# EAGLE design IEEEAdapter_v1 (EAGLE 5.11)
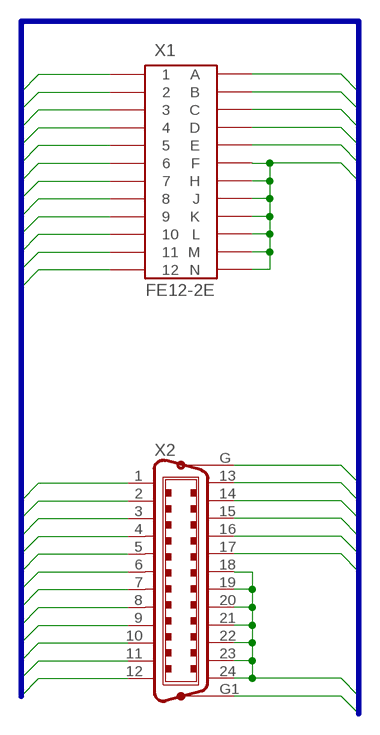
[diagram p0: schematic, sheet 1]

## Parts
X1  FE12-2E  [FE12-2_SHORT]
X2  C24HP  [24HP]

## Nets
ATN: X1.11 X2.11
D0: X1.1 X2.1
D1: X1.2 X2.2
D2: X1.3 X2.3
D3: X1.4 X2.4
D4: X1.A X2.13
D5: X1.B X2.14
D6: X1.C X2.15
D7: X1.D X2.16
DAV: X1.6 X2.6
EOI: X1.5 X2.5
GND: X1.12 X1.F X1.H X1.J X1.K X1.L X1.M X1.N X2.12 X2.18 X2.19 X2.20 X2.21 X2.22 X2.23 X2.24 X2.G X2.G1
IFC: X1.9 X2.9
NDAC: X1.8 X2.8
NRFD: X1.7 X2.7
REN: X1.E X2.17
SRQ: X1.10 X2.10

## Buses
D0,D1,D2,D3,EOI,DAV,NRFD,NDAC,IFC,SRQ,ATN,CHASSIS_GND,D4,D5,D6,D7,REN,GND

## Library data of the parts
X1 = con-edge-156:FE12-2
X2 = con-amp-champ:C24HP: CONNECTOR; OC_FARNELL: unknown; OC_NEWARK: unknown

## Board
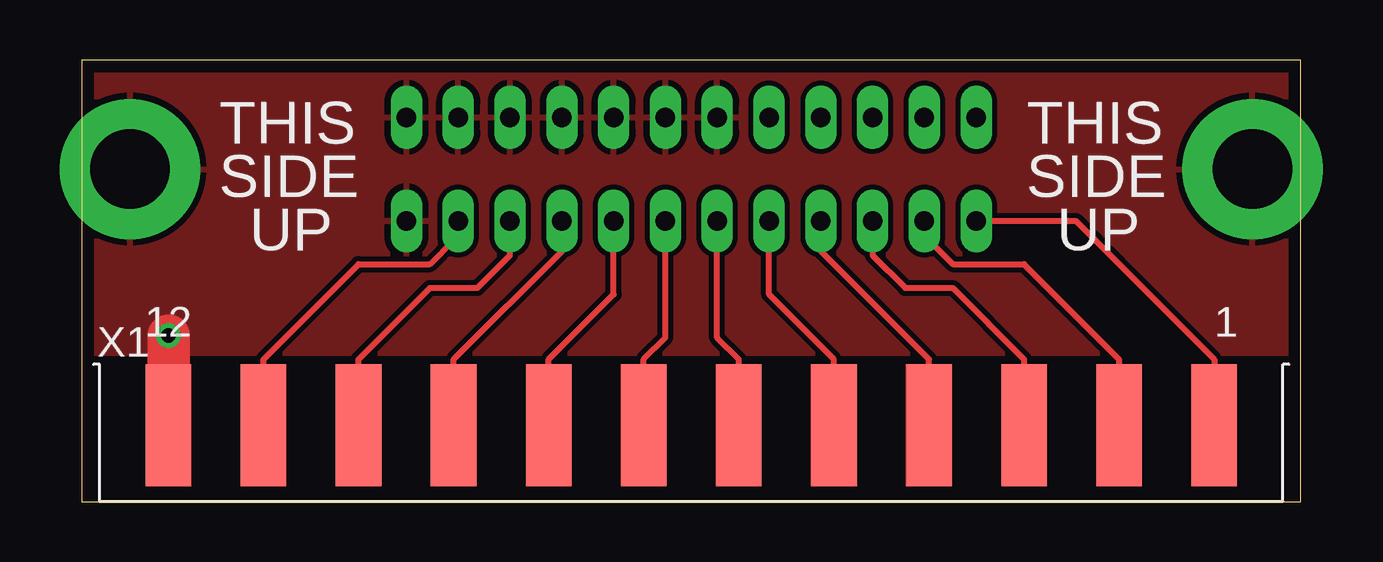
[diagram p1: board, top side]
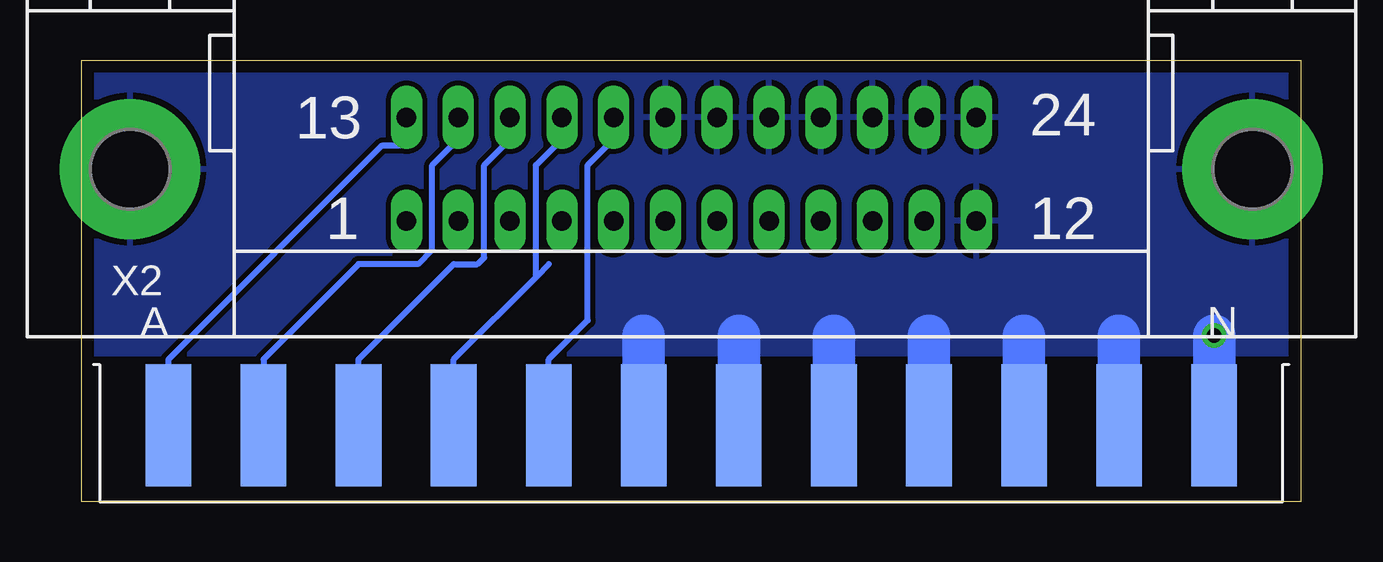
[diagram p2: board, bottom side, seen from below]

Size 50.8 x 18.41 mm. Coordinates in mm from the lower left corner, seen from the top.
Outline: 0,0 50.8,0 50.8,18.41 0,18.41 0,0
Copper layers (1*16): Top 0.035mm / dielectric 1.5mm / Bottom 0.035mm
Design rules "default *": minimum track width 10mil, minimum drill 24mil, track to track 8mil, track to pad 8mil, pad to pad 8mil, via to via 8mil, smd to smd 8mil, copper to edge 20mil, drill to drill 8mil, minimum pad ring 10mil, minimum via ring 8mil, stop-mask expansion 4mil, vias tented up to drill 0mil, thermal gap 10mil

### Footprints (pad centres in the part's own frame; a part is rotated, then mirrored left to right if it is on the bottom)
FE12-2_SHORT = smd 1.905 x 5.08: 1 -21.793,-0.216; 2 -17.831,-0.216; 3 -13.868,-0.216; 4 -9.906,-0.216; 5 -5.944,-0.216; 6 -1.981,-0.216; 7 1.981,-0.216; 8 5.944,-0.216; 9 9.906,-0.216; 10 13.868,-0.216; 11 17.831,-0.216; 12 21.793,-0.216 | smd 1.905 x 5.08 bottom: A -21.793,-0.216; B -17.831,-0.216; C -13.868,-0.216; D -9.906,-0.216; E -5.944,-0.216; F -1.981,-0.216; H 1.981,-0.216; J 5.944,-0.216; K 9.906,-0.216; L 13.868,-0.216; M 17.831,-0.216; N 21.793,-0.216
24HP = drill 0.813 long: 1 -11.874,-2.159; 2 -9.716,-2.159; 3 -7.556,-2.159; 4 -5.397,-2.159; 5 -3.239,-2.159; 6 -1.079,-2.159; 7 1.079,-2.159; 8 3.239,-2.159; 9 5.397,-2.159; 10 7.556,-2.159; 11 9.716,-2.159; 12 11.874,-2.159; 13 -11.874,2.159; 14 -9.716,2.159; 15 -7.556,2.159; 16 -5.397,2.159; 17 -3.239,2.159; 18 -1.079,2.159; 19 1.079,2.159; 20 3.239,2.159; 21 5.397,2.159; 22 7.556,2.159; 23 9.716,2.159; 24 11.874,2.159 | drill 3.302 pad 5.842: G -23.393,0; G1 23.393,0

### Placement (x,y rotation side)
X1  25.4,2.97 180 top
X2  25.4,13.87 0 bottom

### Tracks (layer width: path | path; a pad name or v marks a point on that pad's centre or on a via)
ATN
  Top 0.254: X1.11 7.57,5.94 11.53,9.91 14.5,9.91 15.49,10.9 15.49,11.52 X2.11
D0
  Top 0.254: X1.1 47.19,5.94 41.43,11.71 X2.1
D1
  Top 0.254: X1.2 43.23,5.94 39.27,9.91 36.3,9.91 35.12,11.09 X2.2
D2
  Top 0.254: X1.3 39.27,5.94 36.3,8.91 34.31,8.91 32.96,10.27 X2.3
D3
  Top 0.254: X1.4 35.31,5.94 30.8,10.45 X2.4
D4
  Bottom 0.254: X1.A 47.19,5.94 38.28,14.86 37.53,14.86 37.27,15.11 X2.13
D5
  Bottom 0.254: X1.B 43.23,5.94 39.27,9.91 36.79,9.91 36.2,10.5 36.2,14.03 35.12,15.11 X2.14
D6
  Bottom 0.254: X1.C 39.27,5.94 35.31,9.91 34.31,9.91 34.04,10.19 34.04,14.03 32.96,15.11 X2.15
D7
  Bottom 0.254: X1.D 35.31,5.94 31.84,9.41 | 31.84,9.41 31.34,9.91 | X2.16 30.8,15.11 31.88,14.03 31.88,9.45 31.84,9.41
DAV
  Top 0.254: X1.6 27.38,5.94 26.48,6.84 X2.6
EOI
  Top 0.254: X1.5 31.34,5.94 28.64,8.65 X2.5
GND  (via drill 0.61)
  Top 1.778: X1.12 v3.61,6.93
  Bottom 1.778: v3.61,6.93 X1.12 | X1.M 7.57,6.93 | X1.L 11.53,6.93 | X1.K 15.49,6.93 | X1.J 19.46,6.93 | X1.H 23.42,6.93 | X1.F 27.38,6.93
  pour Top: 0,18.41 50.8,18.41 50.8,6.19 0,6.19
  pour Bottom: 0,18.41 50.8,18.41 50.8,6.19 0,6.19
IFC
  Top 0.254: X1.9 15.49,5.94 20,10.45 X2.9
NDAC
  Top 0.254: X1.8 19.46,5.94 22.16,8.65 X2.8
NRFD
  Top 0.254: X1.7 23.42,5.94 24.32,6.84 X2.7
REN
  Bottom 0.254: X1.E 31.34,5.94 29.72,7.57 29.72,14.03 28.64,15.11 X2.17
SRQ
  Top 0.254: X1.10 11.53,5.94 14.5,8.91 16.48,8.91 17.84,10.27 X2.10

### Text on the board
tNames: THIS | THIS | SIDE | SIDE | UP | UP
tValues: PET<->IEEE Adapter | www.go4retro.com